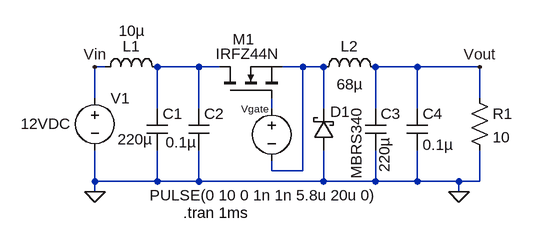
[diagram p0: schematic BUCK CONVERTER.asc]
BUCK CONVERTER.asc, the LTspice schematic file:
Version 4.1
SHEET 1 880 680
WIRE -80 0 -96 0
WIRE 64 0 0 0
WIRE 96 0 64 0
WIRE 224 0 192 0
WIRE 256 0 224 0
WIRE 400 0 336 0
WIRE 496 0 400 0
WIRE -96 48 -96 0
WIRE 496 48 496 0
WIRE 0 64 0 0
WIRE 64 64 64 0
WIRE 176 64 176 48
WIRE 256 64 256 0
WIRE 336 64 336 0
WIRE 400 64 400 0
WIRE 176 160 176 144
WIRE 224 160 224 0
WIRE 224 160 176 160
WIRE -96 176 -96 128
WIRE 0 176 0 128
WIRE 0 176 -96 176
WIRE 64 176 64 128
WIRE 64 176 0 176
WIRE 256 176 256 128
WIRE 256 176 64 176
WIRE 336 176 336 128
WIRE 336 176 256 176
WIRE 400 176 400 128
WIRE 400 176 336 176
WIRE 464 176 400 176
WIRE 496 176 496 128
WIRE 496 176 464 176
WIRE -96 192 -96 176
WIRE 464 192 464 176
FLAG -96 0 Vin
FLAG -96 192 0
FLAG 496 0 Vout
FLAG 464 192 0
SYMBOL nmos 96 48 R270
WINDOW 0 91 20 VRight 2
WINDOW 3 68 -6 VRight 2
SYMATTR InstName M1
SYMATTR Value IRFZ44N
SYMBOL voltage -96 32 R0
WINDOW 3 -114 55 Left 2
WINDOW 123 0 0 Left 0
WINDOW 39 0 0 Left 0
SYMATTR Value 12VDC
SYMATTR InstName V1
SYMBOL schottky 272 128 R180
WINDOW 0 -25 59 Left 2
WINDOW 3 -34 -44 VRight 2
SYMATTR InstName D1
SYMATTR Value MBRS340
SYMBOL cap -16 64 R0
WINDOW 3 -45 47 Left 2
SYMATTR Value 220µ
SYMATTR InstName C1
SYMBOL cap 48 64 R0
WINDOW 3 -35 52 Left 2
SYMATTR Value 0.1µ
SYMATTR InstName C2
SYMBOL cap 320 64 R0
WINDOW 3 29 44 VRight 2
SYMATTR Value 220µ
SYMATTR InstName C3
SYMBOL cap 384 64 R0
SYMATTR InstName C4
SYMATTR Value 0.1µ
SYMBOL ind 240 16 R270
WINDOW 0 32 56 VTop 2
WINDOW 3 5 56 VBottom 2
SYMATTR InstName L2
SYMATTR Value 68µ
SYMATTR SpiceLine Rser=0.1
SYMBOL voltage 176 48 R0
WINDOW 0 -47 16 Left 1
WINDOW 3 -188 149 Left 2
WINDOW 123 0 0 Left 0
WINDOW 39 0 0 Left 0
SYMATTR InstName Vgate
SYMATTR Value PULSE(0 10 0 1n 1n 5.8u 20u 0)
SYMBOL ind -96 16 R270
WINDOW 0 32 56 VTop 2
WINDOW 3 87 57 VBottom 2
SYMATTR InstName L1
SYMATTR Value 10µ
SYMATTR SpiceLine Rser=0.1
SYMBOL res 480 32 R0
SYMATTR InstName R1
SYMATTR Value 10
TEXT 40 224 Left 2 !.tran 1ms

The netlist it stands for:
* BUCK CONVERTER.asc
M1 N001 N003 N002 N002 IRFZ44N
V1 Vin 0 12VDC
D1 0 N002 MBRS340
C1 N001 0 220µ
C2 N001 0 0.1µ
C3 Vout 0 220µ
C4 Vout 0 0.1µ
L2 N002 Vout 68µ Rser=0.1
Vgate N003 N002 PULSE(0 10 0 1n 1n 5.8u 20u 0)
L1 Vin N001 10µ Rser=0.1
R1 Vout 0 10
.model D D
.lib standard.dio
.model NMOS NMOS
.model PMOS PMOS
.lib standard.mos
.tran 1ms
.backanno
.end